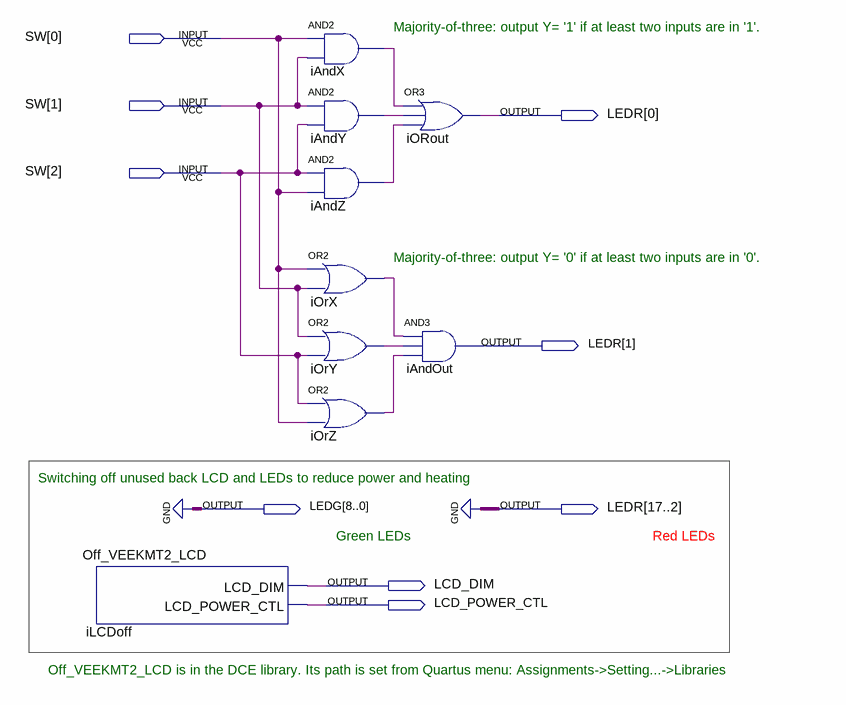
[diagram p0: schematic sheet]
// Quartus schematic ExampleMajority3.bdf as structural Verilog: 9 symbols, 9 pins
module ExampleMajority3 (
  input  [2:0] SW,
  output [17:0] LEDR,
  output [8:0] LEDG,
  output LCD_DIM,
  output LCD_POWER_CTL
);

  wire iAndX_out, iAndY_out, iAndZ_out, iOrX_out, iOrY_out, iOrZ_out;

  Off_VEEKMT2_LCD iLCDoff (.LCD_DIM(LCD_DIM), .LCD_POWER_CTL(LCD_POWER_CTL));
  and iAndX (iAndX_out, SW[0], SW[1]);
  and iAndY (iAndY_out, SW[1], SW[2]);
  and iAndZ (iAndZ_out, SW[2], SW[0]);
  or iOrX (iOrX_out, SW[0], SW[1]);
  or iOrY (iOrY_out, SW[1], SW[2]);
  or iOrZ (iOrZ_out, SW[2], SW[0]);
  or iORout (LEDR[0], iAndX_out, iAndY_out, iAndZ_out);
  and iAndOut (LEDR[1], iOrX_out, iOrY_out, iOrZ_out);

  assign LEDG = {9{1'b0}};
  assign LEDR[17:2] = {16{1'b0}};

  // Notes on the sheet:
  //   Majority-of-three: output Y= '1' if at least two inputs are in '1'.
  //   Majority-of-three: output Y= '0' if at least two inputs are in '0'.
  //   Switching off unused back LCD and LEDs to reduce power and heating
  //   Green LEDs
  //   Red LEDs
  //   Off_VEEKMT2_LCD is in the DCE library. Its path is set from Quartus menu: Assignments->Setting...->Libraries
endmodule
